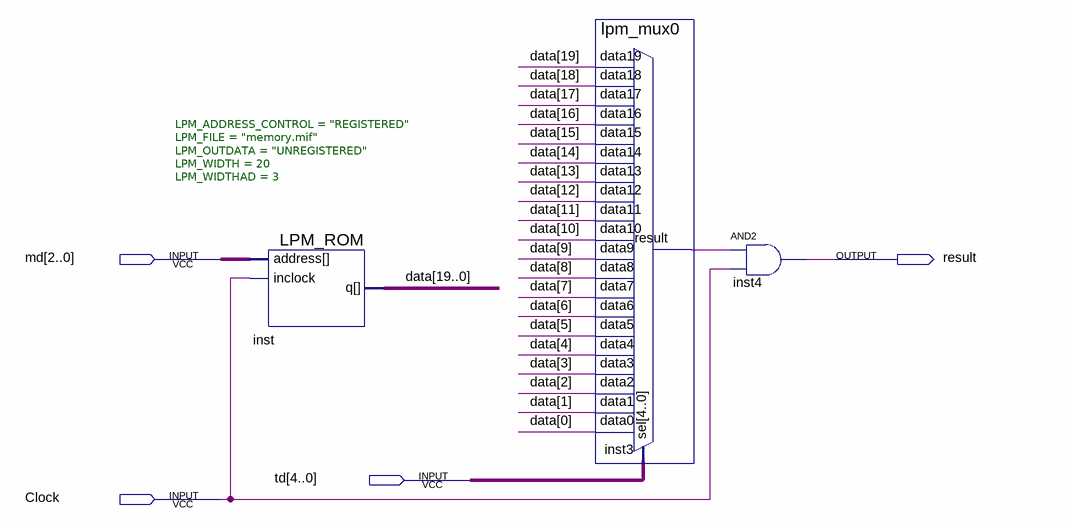
[diagram p0: schematic sheet]
// Quartus schematic prom_mux.bdf as structural Verilog: 3 symbols, 4 pins
module prom_mux (
  input  [2:0] md,
  input  [4:0] td,
  input  Clock,
  output result
);

  wire inst3_result;
  wire [19:0] data;

  LPM_ROM #(.LPM_ADDRESS_CONTROL("REGISTERED"), .LPM_FILE("memory.mif"), .LPM_OUTDATA("UNREGISTERED"), .LPM_WIDTH(20), .LPM_WIDTHAD(3)) inst (
    .address(md), .inclock(Clock), .q(data));
  lpm_mux0 inst3 (
    .data19(data[19]), .data18(data[18]), .data17(data[17]), .data16(data[16]), .data15(data[15]),
    .data14(data[14]), .data13(data[13]), .data12(data[12]), .data11(data[11]), .data10(data[10]),
    .data9(data[9]), .data8(data[8]), .data7(data[7]), .data6(data[6]), .data5(data[5]), .data4(data[4]),
    .data3(data[3]), .data2(data[2]), .data1(data[1]), .data0(data[0]), .sel(td), .result(inst3_result));
  and inst4 (result, inst3_result, Clock);
endmodule
